# Altium schematic sheet RS232-U4_U7.SchDoc: RS232
size A3; Date: 05.12.2021; CompanyName: ITU AUV; DrawnBy: SÜEDA KORKMAZ; Revision: 05.12.2021; Designed By: Süeda KORKMAZ
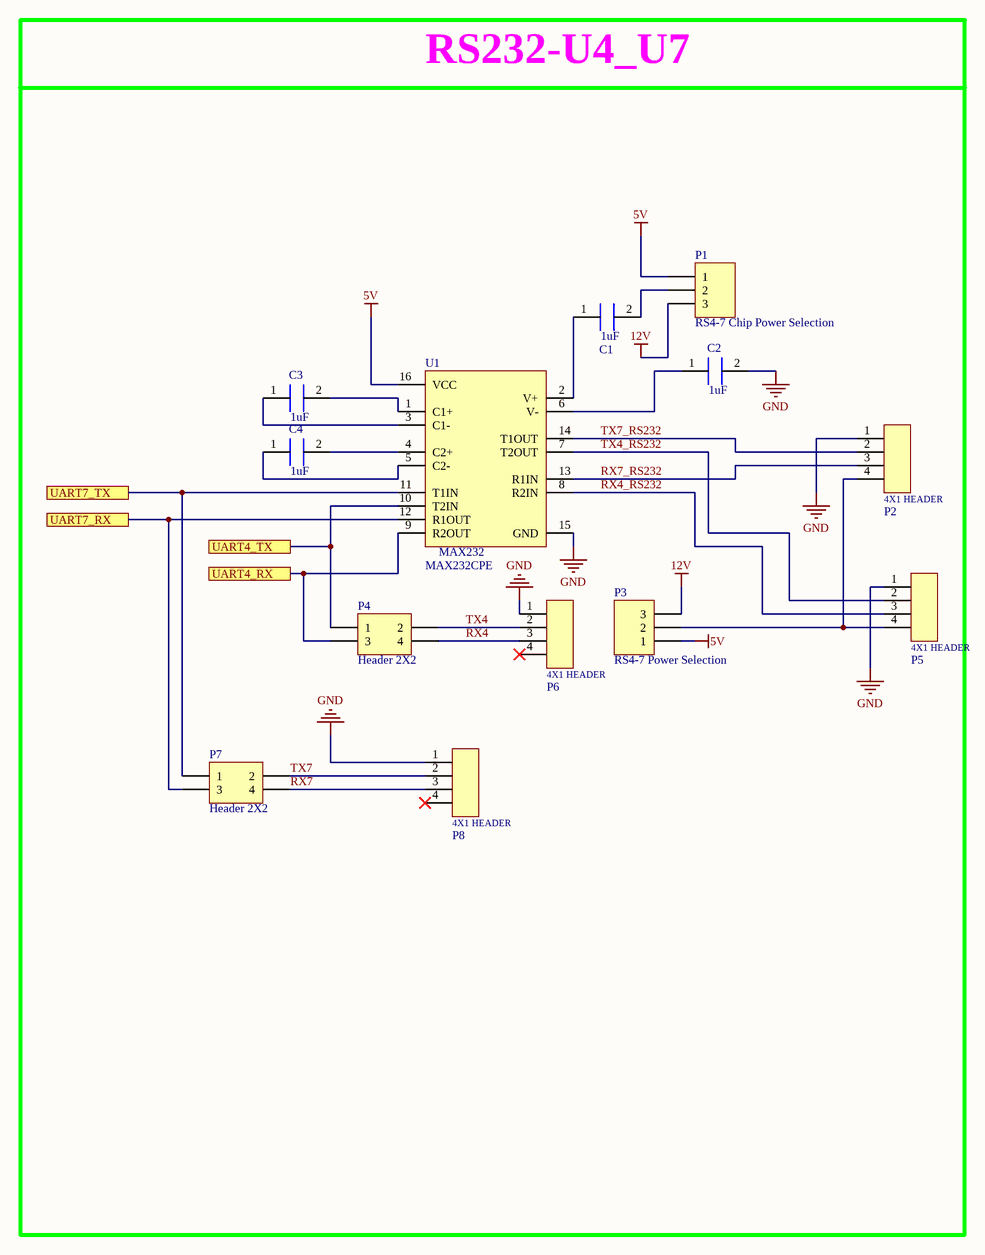
[diagram p0: RS232-U4_U7.SchDoc]

## Parts
C1  CAP CER 1UF 25V X7R 0805  [C0805C105J3RAC7800]  (value not drawn)
C2  CAP CER 1UF 25V X7R 0805  [C0805C105J3RAC7800]  (value not drawn)
C3  CAP CER 1UF 25V X7R 0805  [C0805C105J3RAC7800]  (value not drawn)
C4  CAP CER 1UF 25V X7R 0805  [C0805C105J3RAC7800]  (value not drawn)
P1  RS4-7 Chip Power Selection  [HDR1X3]
P2  WIRE-TO BOARD HEADER, 2.5MM, 4 C  [51125-04-0200-01]  (value not drawn)
P3  RS4-7 Power Selection  [HDR1X3]
P4  Header 2X2  [HDR2X2]
P5  WIRE-TO BOARD HEADER, 2.5MM, 4 C  [51125-04-0200-01]  (value not drawn)
P6  WIRE-TO BOARD HEADER, 2.5MM, 4 C  [51125-04-0200-01]  (value not drawn)
P7  Header 2X2  [HDR2X2]
P8  WIRE-TO BOARD HEADER, 2.5MM, 4 C  [51125-04-0200-01]  (value not drawn)
U1  MAX232CPE  [MAX232CPE]

## Blocks framed on the sheet
RS232-U4_U7: C1-C4 P1-P8 U1

## Ports
UART4_RX, UART4_TX, UART7_RX, UART7_TX

## Nets
5V: P1.1 P3.1 U1.16(VCC)
12V: P1.3 P3.3
GND: C2.2 P2.1 P5.1 P6.1 P8.1 U1.15(GND)
RX4: P4.4 P6.3
RX4_RS232: P5.3 U1.8(R2IN)
RX7: P7.4 P8.3
RX7_RS232: P2.3 U1.13(R1IN)
TX4: P4.2 P6.2
TX4_RS232: P5.2 U1.7(T2OUT)
TX7: P7.2 P8.2
TX7_RS232: P2.2 U1.14(T1OUT)
UART4_RX: P4.3 U1.9(R2OUT) ; port UART4_RX
UART4_TX: P4.1 U1.10(T2IN) ; port UART4_TX
UART7_RX: P7.3 U1.12(R1OUT) ; port UART7_RX
UART7_TX: P7.1 U1.11(T1IN) ; port UART7_TX
NetC1_1: C1.1 U1.2(V+)
NetC1_2: C1.2 P1.2
NetC2_1: C2.1 U1.6(V-)
NetC3_1: C3.1 U1.3(C1-)
NetC3_2: C3.2 U1.1(C1+)
NetC4_1: C4.1 U1.5(C2-)
NetC4_2: C4.2 U1.4(C2+)
NetP2_4: P2.4 P3.2 P5.4

Not connected (* = marked no-connect by the designer): P6 4(6)*; P8 4(6)*

## Notes on the sheet
- (in symbol 51125-04-0200-01) 4X1 HEADER

## Library data of the parts
C1-C4 = C0805C105J3RAC7800: Cap Ceramic 1uF 25V X7R 5% SMD 0805 125C Plastic T/R; Manufacturer: KEMET; Manufacturer Part Number: C0805C105J3RACTU; Supplier 1: Farnell; RoHS: Yes; Category: Ceramic Capacitors; Stock 1: 72500; Pricing 1: 2500=0,29500 (EUR); Mount: Surface Mount; Case/Package: 0805; Case Code (Metric): 2012; Case Code (Imperial): 0805; Dielectric Material: Ceramic; Min Operating Temperature: -55°C; Max Operating Temperature: 125°C; Package Quantity: 1; Capacitance: 1uF; Voltage Rating: 25V; Tolerance: 5%; Packaging: Tape and Reel; Voltage Rating (DC): 25V; Dielectric: X7R; Termination: SMD/SMT; Series: C; Length: 2mm; Width: 0.049inch; Thickness: 0.055inch; Depth: 1.25mm; Radiation Hardening: No; REACH SVHC: No SVHC; RoHS Compliant: Yes; ComponentLink1URL: http://components.arrow.com/part/dataview/46126037S66869N7429?src-supplier=Arrow+Electronics; ComponentLink1Description: http://components.arrow.com/part/dataview/46126037S66869N7429?src-supplier=Arrow+Electronics; ComponentLink2URL: http://www.farnell.com/datasheets/2745929.pdf?src-supplier=Farnell; ComponentLink2Description: http://www.farnell.com/datasheets/2745929.pdf?src-supplier=Farnell; ComponentLink3URL: http://www.mouser.com/ds/2/212/KEM_C1002_X7R_SMD-1102033.pdf?src-supplier=Mouser; ComponentLink3Description: http://www.mouser.com/ds/2/212/KEM_C1002_X7R_SMD-1102033.pdf?src-supplier=Mouser; ComponentLink4URL: http://components.arrow.com/part/dataview/0323_00011351?src-supplier=Arrow+Europe; ComponentLink4Description: http://components.arrow.com/part/dataview/0323_00011351?src-supplier=Arrow+Europe; ComponentLink5URL: https://api.kemet.com/component-edge/download/datasheet/C0805C105J3RACTU.pdf?src-supplier=Digi-Key; ComponentLink5Description: https://api.kemet.com/component-edge/download/datasheet/C0805C105J3RACTU.pdf?src-supplier=Digi-Key; ComponentLink6URL: http://www.farnell.com/datasheets/2745929.pdf?src-supplier=Newark; ComponentLink6Description: http://www.farnell.com/datasheets/2745929.pdf?src-supplier=Newark; ComponentLink7URL: http://www.farnell.com/datasheets/2745929.pdf?src-supplier=Element14; ComponentLink7Description: http://www.farnell.com/datasheets/2745929.pdf?src-supplier=Element14
P1 P3 = Header 3: Header, 3-Pin; LatestRevisionDate: 17-Jul-2002; LatestRevisionNote: Re-released for DXP Platform.; Publisher: Altium Limited
P2 = 51125-04-0200-01: RS7 Port; Manufacturer: CNC Tech; Supplier 1: Digi-Key; Manufacturer Part Number: 51125-04-0200-01; RoHS: No; Category: Connectors; Stock 1: 5369; Pricing 1: 1=0,21000, 10=0,17700, 100=0,13650, 500=0,11550, 1000=0,09450, 5000=0,08400, 10000=0,07613 (USD); Supplier Part Number 1: 1175-51125-04-0200-01-ND
P4 P7 = Header 2X2: Header, 2-Pin, Dual row; LatestRevisionDate: 17-Jul-2002; LatestRevisionNote: Re-released for DXP Platform.; Publisher: Altium Limited
P5 P6 P8 = 51125-04-0200-01: Manufacturer: CNC Tech; Supplier 1: Digi-Key; Manufacturer Part Number: 51125-04-0200-01; RoHS: No; Category: Connectors; Stock 1: 5369; Pricing 1: 1=0,21000, 10=0,17700, 100=0,13650, 500=0,11550, 1000=0,09450, 5000=0,08400, 10000=0,07613 (USD); Supplier Part Number 1: 1175-51125-04-0200-01-ND
U1 = MAX232CPE: MAX232 Series 120 kbps 5.5 V Through Hole RS-232 Transceiver - PDIP-16; Manufacturer: Maxim; Manufacturer Part Number: MAX232CPE+; Propagation Delay: 10us; Number of Transmitters: 2; Operating Supply Voltage: 5V; Min Supply Voltage: 4.5V; Max Supply Voltage: 5.5V; Operating Supply Current: 10mA; Number of Transceivers: 1; Supply Type: Single; Supplier 1: Farnell; RoHS: Yes; Category: RS-232 / RS-422 / RS-485 Interface ICs; Stock 1: 9660; Pricing 1: 1=4,80000, 10=3,86000, 25=3,63000, 50=3,48000, 100=3,32000, 250=3,29000, 500=3,24000 (EUR); Mount: Through Hole; Case/Package: PDIP; Number of Pins: 16; Weight: 0.056438oz; Contact Plating: Tin,Matte; Min Operating Temperature: 0°C; Max Operating Temperature: 70°C; Packaging: Rail/Tube; Package Quantity: 25; Number of Receivers: 2; Data Rate: 120Kbps; Interface: RS-232; Logic Function: Transceiver; Number of Drivers: 2; Type: Integrated Circuit (IC); Series: MAX232; Length: 19.43mm; Width: 7.87mm; Height: 4.45mm; Radiation Hardening: No; REACH SVHC: No SVHC; Lead Free: Lead Free; RoHS Compliant: Yes; ComponentLink1URL: https://datasheet.ciiva.com/22828/0900766b807c18c1-22828294.pdf?src-supplier=RSComponents; ComponentLink1Description: https://datasheet.ciiva.com/22828/0900766b807c18c1-22828294.pdf?src-supplier=RSComponents; ComponentLink2URL: https://datasheet.ciiva.com/29306/170049-da-01-en-ic-max232cpe-dip16-29306280.pdf?src-supplier=Conrad; ComponentLink2Description: https://datasheet.ciiva.com/29306/170049-da-01-en-ic-max232cpe-dip16-29306280.pdf?src-supplier=Conrad; ComponentLink3URL: https://datasheet.ciiva.com/26833/max232cpe-26833420.pdf?src-supplier=IIIC; ComponentLink3Description: https://datasheet.ciiva.com/26833/max232cpe-26833420.pdf?src-supplier=IIIC; ComponentLink4URL: https://datasheet.ciiva.com/26833/max232cpe-26833436.pdf?src-supplier=IIIC; ComponentLink4Description: https://datasheet.ciiva.com/26833/max232cpe-26833436.pdf?src-supplier=IIIC; ComponentLink5URL: https://datasheet.ciiva.com/18410/70157118-18410440.pdf?src-supplier=Allied+Electronics; ComponentLink5Description: https://datasheet.ciiva.com/18410/70157118-18410440.pdf?src-supplier=Allied+Electronics; ComponentLink6URL: https://datasheet.ciiva.com/3028/max220-max249-3028373.pdf?src-supplier=Avnet; ComponentLink6Description: https://datasheet.ciiva.com/3028/max220-max249-3028373.pdf?src-supplier=Avnet